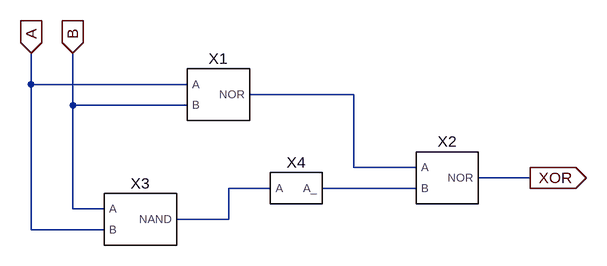
[diagram p0: schematic XOR2.asc]
XOR2.asc, the LTspice schematic file:
Version 4
SHEET 1 880 680
WIRE -80 80 -80 32
WIRE 160 80 -80 80
WIRE 416 96 256 96
WIRE -16 112 -16 32
WIRE 160 112 -16 112
WIRE 416 208 416 96
WIRE 512 208 416 208
WIRE 688 224 608 224
WIRE 288 240 224 240
WIRE 512 240 368 240
WIRE -16 272 -16 112
WIRE 32 272 -16 272
WIRE 224 288 224 240
WIRE 224 288 144 288
WIRE -80 304 -80 80
WIRE 32 304 -80 304
FLAG -80 32 A
IOPIN -80 32 In
FLAG -16 32 B
IOPIN -16 32 In
FLAG 688 224 XOR
IOPIN 688 224 Out
SYMBOL NOR 208 96 R0
SYMATTR InstName X1
SYMBOL NOR 560 224 R0
SYMATTR InstName X2
SYMBOL NAND 80 288 R0
SYMATTR InstName X3
SYMBOL INVERT 320 240 R0
SYMATTR InstName X4

The netlist it stands for:
* XOR2.asc
XX1 A B N001 NOR  ; pins A B NOR
XX2 N001 N003 XOR NOR  ; pins A B NOR
XX3 B A N002 NAND  ; pins A B NAND
XX4 N002 N003 INVERT  ; pins A A_
.backanno
.end